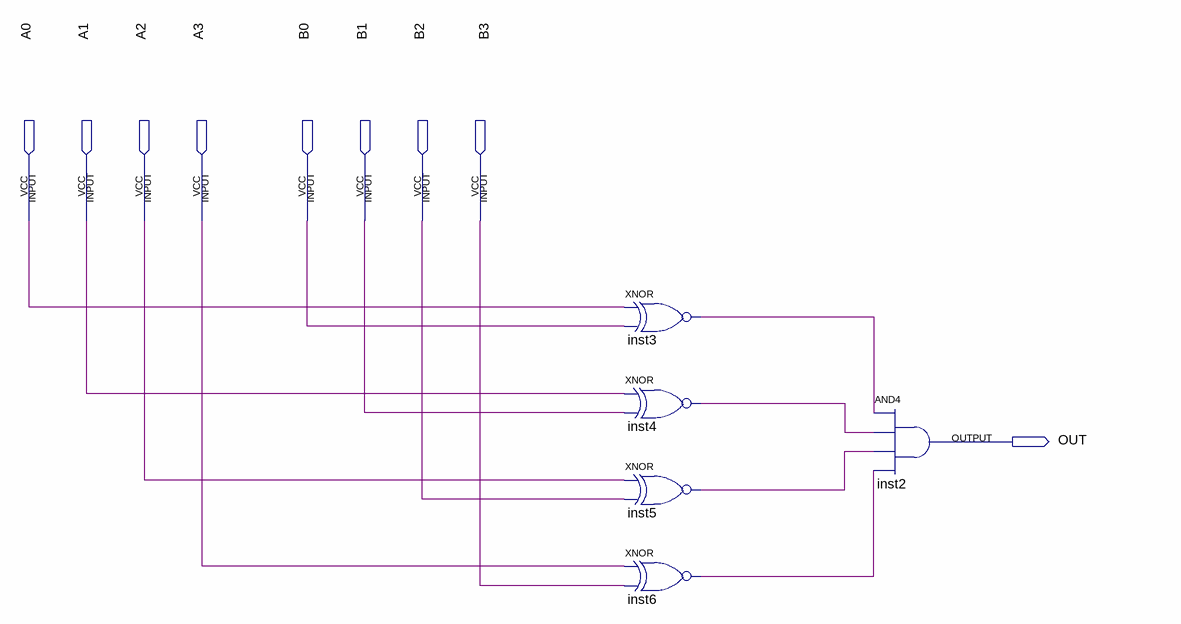
[diagram p0: schematic sheet]
// Quartus schematic COMPARADOR.bdf as structural Verilog: 5 symbols, 9 pins
module COMPARADOR (
  input  A0,
  input  A1,
  input  A2,
  input  A3,
  input  B0,
  input  B1,
  input  B2,
  input  B3,
  output OUT
);

  wire inst3_out, inst4_out, inst5_out, inst6_out;

  xnor inst3 (inst3_out, A0, B0);
  xnor inst4 (inst4_out, A1, B1);
  xnor inst5 (inst5_out, A2, B2);
  xnor inst6 (inst6_out, A3, B3);
  and inst2 (OUT, inst3_out, inst4_out, inst5_out, inst6_out);
endmodule
